# Altium schematic sheet 2211B_SysArrosage_auto.SchDoc: Systene d'arrosage auto
size 276 x 198 mm; Author: Garcia Luis; DrawnBy: Garcia Luis; Organization: ETML-ES; SheetNumber: 1; SheetTotal: 2
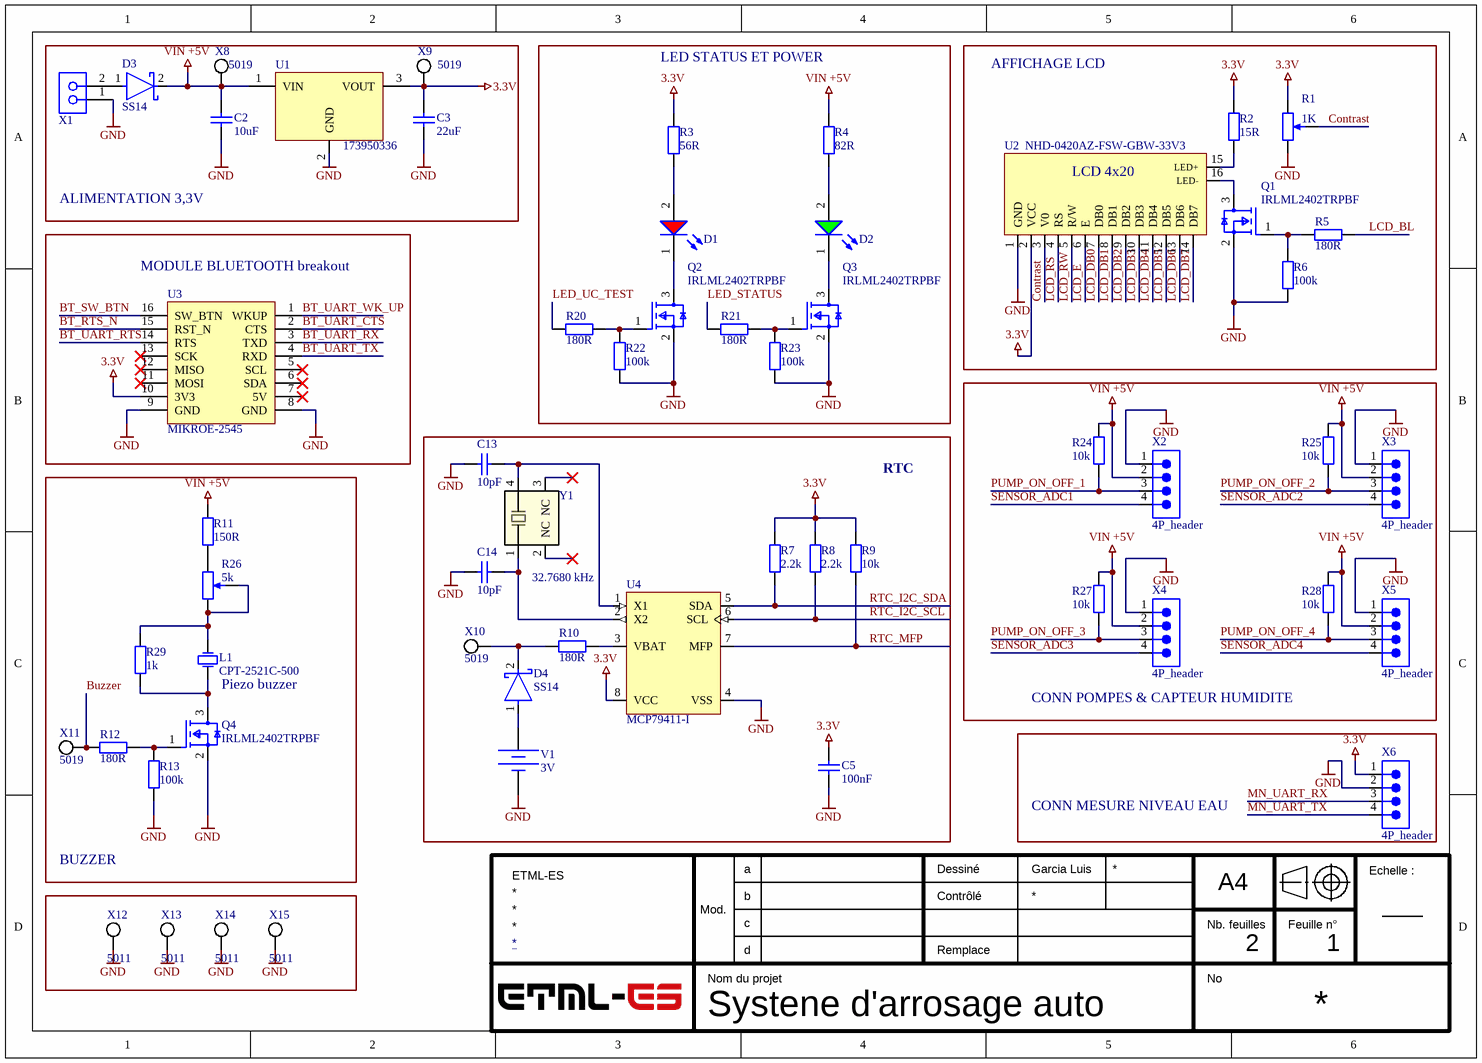
[diagram p0: 2211B_SysArrosage_auto.SchDoc]

## Parts
C2  10uF  [CAPC2013X145X48NL20T23]
C3  22uF  [CAPC2013X145X48NL20T23]
C5  100nF  [CAPC2013X145X48NL20T23]
C13  10pF  [CAPC2013X145X48NL20T23]
C14  10pF  [CAPC2013X145X48NL20T23]
D1  LED_Red_2A-1K  [LEDC2012X75N]  (value not drawn)
D2  LED_Green_2A-1K  [LEDC2012X75N]  (value not drawn)
D3  SS14  [FP-403AE-MFG]
D4  SS14  [FP-403AE-MFG]
L1  CPT-2521C-500  [61300211121]
Q1  IRLML2402TRPBF  [FP-Micro3-IPC_C]
Q2  IRLML2402TRPBF  [FP-Micro3-IPC_C]
Q3  IRLML2402TRPBF  [FP-Micro3-IPC_C]
Q4  IRLML2402TRPBF  [FP-Micro3-IPC_C]
R1  1K  [TRIM_3362P-1-1K]
R2  15R  [RESC2012X60N]
R3  56R  [RESC2012X60N]
R4  82R  [RESC2012X60N]
R5  180R  [RESC2012X60N]
R6  100k  [RESC2012X60N]
R7  2.2k  [RESC2012X60N]
R8  2.2k  [RESC2012X60N]
R9  10k  [RESC2012X60N]
R10  180R  [RESC2012X60N]
R11  150R  [RESC2012X60N]
R12  180R  [RESC2012X60N]
R13  100k  [RESC2012X60N]
R20  180R  [RESC2012X60N]
R21  180R  [RESC2012X60N]
R22  100k  [RESC2012X60N]
R23  100k  [RESC2012X60N]
R24  10k  [RESC2012X60N]
R25  10k  [RESC2012X60N]
R26  5k  [TRIM_3386P-1-502LF_5K]
R27  10k  [RESC2012X60N]
R28  10k  [RESC2012X60N]
R29  1k  [RESC2012X60N]
U1  173950336  [WPME-FDSM_SIP-3_L11.6W7.55H10.16]
U2  NHD-0420AZ-FSW-GBW-33V3  [NHD-0420AZ-FSW-GBW-33V3]
U3  MIKROE-2545  [RN4678 CLICK V3]
U4  MCP79411-I  [SOIC-SN8_M]
V1  DC Magnitude: 3V  [BAT_BU2032SM-HD-G]  (hidden comment: Pile 3V)
X1  Header 1x2  [691214110002]  (value not drawn)
X2  4P_header  [61300411121]
X3  4P_header  [61300411121]
X4  4P_header  [61300411121]
X5  4P_header  [61300411121]
X6  4P_header  [61300411121]
X8  5019  [KEYSTONE_5019]
X9  5019  [KEYSTONE_5019]
X10  5019  [KEYSTONE_5019]
X11  5019  [KEYSTONE_5019]
X12  5011  [Keystone_5011]
X13  5011  [Keystone_5011]
X14  5011  [Keystone_5011]
X15  5011  [Keystone_5011]
Y1  32.7680 kHz  [SOJ_MC-306_EPS-M]

## Blocks framed on the sheet
ALIMENTATION 3,3V: C2 C3 D3 U1 X1 X8 X9
LED STATUS ET POWER: D1 D2 Q2 Q3 R3 R4 R20-R23
AFFICHAGE LCD: Q1 R1 R2 R5 R6 U2
MODULE BLUETOOTH breakout: U3
RTC: C5 C13 C14 D4 R7-R10 U4 V1 X10 Y1
CONN POMPES & CAPTEUR HUMIDITE: R24 R25 R27 R28 X2-X5
CONN MESURE NIVEAU EAU: X6

## Nets
3.3V: C3.2 C5.2 R1.3(CW) R2.2 R3.2 R7.2 R8.2 R9.2 U1.3(VOUT) U2.2(VCC) U3.10(3V3) U4.8(VCC) X6.1 X9.1(TP)
GND: C2.1 C3.1 C5.1 C13.1 C14.1 Q1.2(S) Q2.2(S) Q3.2(S) Q4.2(S) R1.1(CCW) R6.1 R13.2 R22.1 R23.1 U1.2(GND) U2.1(GND) U3.8(GND) U3.9(GND) U4.4(VSS) V1.2 X1.1 X2.1 X3.1 X4.1 X5.1 X6.2 X12.1(TP) X13.1(TP) X14.1(TP) X15.1(TP)
VIN +5V: C2.2 D3.2(C) R4.2 R11.2 R24.2 R25.2 R27.2 R28.2 U1.1(VIN) X2.2 X3.2 X4.2 X5.2 X8.1(TP)
BT_RTS_N: U3.15(RST_N)
BT_SW_BTN: U3.16(SW_BTN)
BT_UART_CTS: U3.2(CTS)
BT_UART_RTS: U3.14(RTS)
BT_UART_RX: U3.3(TXD)
BT_UART_TX: U3.4(RXD)
BT_UART_WK_UP: U3.1(WKUP)
Buzzer: R12.2 X11.1(TP)
Contrast: R1.2(W) U2.3(V0)
LCD_BL: R5.1
LCD_DB0: U2.7(DB0)
LCD_DB1: U2.8(DB1)
LCD_DB2: U2.9(DB2)
LCD_DB3: U2.10(DB3)
LCD_DB4: U2.11(DB4)
LCD_DB5: U2.12(DB5)
LCD_DB6: U2.13(DB6)
LCD_DB7: U2.14(DB7)
LCD_E: U2.6(E)
LCD_RS: U2.4(RS)
LCD_RW: U2.5(R/W)
LED_STATUS: R21.2
LED_UC_TEST: R20.2
MN_UART_RX: X6.3
MN_UART_TX: X6.4
PUMP_ON_OFF_1: R24.1 X2.3
PUMP_ON_OFF_2: R25.1 X3.3
PUMP_ON_OFF_3: R27.1 X4.3
PUMP_ON_OFF_4: R28.1 X5.3
RTC_I2C_SCL: R8.1 U4.6(SCL)
RTC_I2C_SDA: R7.1 U4.5(SDA)
RTC_MFP: R9.1 U4.7(MFP)
SENSOR_ADC1: X2.4
SENSOR_ADC2: X3.4
SENSOR_ADC3: X4.4
SENSOR_ADC4: X5.4
NetC13_2: C13.2 U4.1(X1) Y1.4
NetC14_2: C14.2 U4.2(X2) Y1.1
NetD1_1: D1.1(K) Q2.3(D)
NetD1_2: D1.2(A) R3.1
NetD2_1: D2.1(K) Q3.3(D)
NetD2_2: D2.2(A) R4.1
NetD3_1: D3.1(A) X1.2
NetD4_1: D4.1(A) V1.1
NetD4_2: D4.2(C) R10.2 X10.1(TP)
NetL1_1: L1.1 Q4.3(D) R29.1
NetL1_2: L1.2 R26.1(CCW) R26.2(W) R29.2
NetQ1_1: Q1.1(G) R5.2 R6.2
NetQ1_3: Q1.3(D) U2.16(LED-)
NetQ2_1: Q2.1(G) R20.1 R22.2
NetQ3_1: Q3.1(G) R21.1 R23.2
NetQ4_1: Q4.1(G) R12.1 R13.1
NetR2_1: R2.1 U2.15(LED+)
NetR10_1: R10.1 U4.3(VBAT)
NetR11_1: R11.1 R26.3(CW)

Not connected (* = marked no-connect by the designer): U3 5(SCL)* 6(SDA)* 7(5V)* 11(MOSI)* 12(MISO)* 13(SCK)*; Y1 2(NC)* 3(NC)*

## Notes on the sheet
- (near L1) Piezo buzzer
- BUZZER
- a
- Dessiné
- A4
- Echelle :
- Mod.
- b
- c
- d
- Contrôlé
- Remplace
- Nb. feuilles
- Feuille n°
- Nom du projet
- No
- (in symbol NHD-0420AZ-FSW-GBW-33V3) LCD 4x20

## Library data of the parts
C2 C3 C5 C13 C14 = Capacitor_Non-Polarized
  C2: Capacité: 10uF
  C3: Capacité: 22uF
  C5: Capacité: 100nF
  C13 C14: Capacité: 10pF
D1 = LED_Red_2A-1K: LED Uni-Color Hyper Red 640nm 2-Pin Chip LED T/R; Manufacturer: Kingbright; Manufacturer Part Number: APT2012SECK/J3-PRV; Lens Color: Colorless; Forward Current: 20mA; Forward Voltage: 2.2V; Luminous Intensity: 350mcd; Viewing Angle: 120°; Lens Transparency: Clear; Dominant Wavelength: 625nm; Lens Style: Flat; Lens Size: 1.25mm; Supplier: Digikey; Supplier Part Number: 754-1791-1-ND; RoHS: Yes; Category: LEDs; Stock: 46358; Pricing: 1=0.6, 10=0.368, 100=0.2114, 1000=0.16544 (USD); Mounting Technology: Surface Mount; Case/Package: 0805; Case Code (Metric): 2012; Case Code (Imperial): 0805; Color: Red; Min Operating Temperature: -40°C; Max Operating Temperature: 85°C; Illumination Color: Red; Packaging: Tape and Reel; Package Quantity: 1; Test Current: 20mA; Series: HELI2; Length: 2mm; Width: 1.25mm; Height: 0.75mm; Lead Free: Lead Free; RoHS Compliant: Yes; ComponentLink1URL: https://datasheet.ciiva.com/24022/apt2012seck-j3-prv-262303-24022777.pdf?src-supplier=Mouser; ComponentLink1Description: https://datasheet.ciiva.com/24022/apt2012seck-j3-prv-262303-24022777.pdf?src-supplier=Mouser; ComponentLink2URL: https://datasheet.ciiva.com/29562/apt2012seck-j3-prv-29562108.pdf?src-supplier=Digikey; ComponentLink2Description: https://datasheet.ciiva.com/29562/apt2012seck-j3-prv-29562108.pdf?src-supplier=Digikey
D2 = LED_Green_2A-1K: LED Uni-Color Green 515nm 2-Pin SMD T/R; Manufacturer: Kingbright; Manufacturer Part Number: APHCM2012ZGCK-F01; Lens Color: Colorless; Lens Style: Flat; Lens Transparency: Clear; Luminous Intensity: 350mcd; Forward Voltage: 3.3V; Test Current: 20mA; Viewing Angle: 110°; Dominant Wavelength: 525nm; Lens Size: 1.2mm; Supplier: Digikey; Supplier Part Number: 754-2120-1-ND; RoHS: Yes; Category: LEDs; Stock: 17088; Pricing: 1=0.51, 10=0.311, 100=0.1789, 1000=0.13999 (USD); Mounting Technology: Surface Mount; Case/Package: 0805; Color: Green; Case Code (Imperial): 0805; Case Code (Metric): 2012; Packaging: Cut Tape; Series: -; Length: 2mm; Width: 1.25mm; Height: 0.5mm; RoHS Compliant: Yes; ComponentLink1URL: http://www.kingbrightusa.com/images/catalog/SPEC/APHCM2012ZGCK-F01.pdf?src-supplier=Digikey; ComponentLink1Description: http://www.kingbrightusa.com/images/catalog/SPEC/APHCM2012ZGCK-F01.pdf?src-supplier=Digikey
D3 D4 = CMP-2000-04943-2: DIODE SCHOTTKY 40V 1A SMA; Manufacturer: ON Semiconductor; Peak Reverse Current: 0.2mA; Max Junction Temp: +125°C; Standoff Height: 0.05mm; Max Surge Forward Current: 40A; Mouser Description: Schottky Diodes & Rectifiers SMA 40V 1.0A; RoHS: TRUE; Lead Free: Yes; Manufacturer Part Number: SS14; Device Class L3: Schottky Diodes; Category: Diode; Automotive: No; Digikey Description: DIODE SCHOTTKY 40V 1A SMA; ComponentLink2Description: Datasheet; Device Class L2: Diodes; Height: 2.5mm; Temperature Range High: +125°C; ComponentLink2URL: https://www.onsemi.com/pub/Collateral/SS19-D.PDF; Device Class L1: Discrete Semiconductors; Package: 403AE; Octopart: https://octopart.com/ss14-on+semiconductor-29205033; Max Repetitive Reverse Voltage: 40V; Temperature Range Low: -65°C; Forward Current: 1A; Temperature: -65°C to +125°C
L1 = Buzzer: AUDIO PIEZO TRANSDUCER 50V CHAS; Manufacturer: CUI Devices; Supplier: Digikey; Supplier Part Number: 102-3756-ND; Manufacturer Part Number: CPT-2521C-500; RoHS: No; Category: Buzzers; Stock: 2415; Pricing: 1=5.57, 10=4.594, 30=4.23467, 60=3.97467, 90=3.72456, 450=3.29809 (USD); ComponentLink1URL: https://www.cuidevices.com/product/resource/digikeypdf/cpt-2521c-500.pdf?src-supplier=Digikey; ComponentLink1Description: https://www.cuidevices.com/product/resource/digikeypdf/cpt-2521c-500.pdf?src-supplier=Digikey
Q1-Q4 = CMP-32901-000179-1: MOSFET N-CH 20V 1.2A SOT-23; Manufacturer: Infineon; Max Power Dissipation: 540mW; Gate to Source Voltage (Vgs): 12V; Drain to Source Resistance: 350mR; Rise Time: 9.5ns; Threshold Voltage: 700mV; Turn-On Delay Time: 2.5ns; Input Capacitance: 110pF; Element Configuration: Single; Power Dissipation: 540W; Turn-Off Delay Time: 9.7ns; Rds On Max: 250mR; REACH SVHC: No SVHC; Mount: Surface Mount; Packaging: Tape and Reel; Height: 0.04inch; Drain to Source Voltage (Vdss): 20V; Length: 0.119inch; Contact Plating: Tin; Continuous Drain Current (ID): 1.2A; Lead Free: Lead Free; Drain to Source Breakdown Voltage: 20V; Max Dual Supply Voltage: 20V; Number of Pins: 3; Halogen Free: Halogen Free; Max Operating Temperature: 150°C; Case/Package: SOT-23; Min Operating Temperature: -55°C; Width: 0.055inch; Manufacturer Part Number: IRLML2402TRPBF
R1 = RPot: In a Tube of 50, 1kO Through Hole Trimmer Potentiometer 0.5W Top Adjust Bourns 3362 Series; Manufacturer Part Number: 3362P-1-102LF; Manufacturer Series: 3362; Tolerance: 10%; Number of Turns: 1; Voltage Rating (AC): 300V; Power Rating: 500mW; Temperature Coefficient: 100ppm/°C; Resistance Law: Linear; Actuator Orientation: Vertical; Actuator Type: SCREW; Lead Diameter: 0.46mm; Resistance: 1kR; Published: 17-Dec-2003; DatasheetVersion: Oct-2003; PackageReference: POT4MM-2; Publisher: Altium Limited; PackageDescription: Square Trimming Potentiometer; ComponentLink1Description: Manufacturer Link; ComponentLink1URL: http://bourns.com/2/search.html; Supplier 1: Arrow Electronics; Manufacturer: Bourns; RoHS: Yes; Category: Variable Resistors and Potentiometers; Stock 1: 2500; Pricing 1: 250=0,5725, 500=0,5525, 1000=0,5024, 2500=0,4458, 10000=0,4425 (USD); Mount: Through Hole,PCB; Number of Pins: 3; Weight: 0.02oz; Terminal Finish: Tin; Color: 48Colour; Min Operating Temperature: -55°C; Max Operating Temperature: 125°C; Packaging: Rail/Tube; Resistor Type: Cermet; Termination: Pin; Series: Trimpot® 3362 - Sealed; Voltage Rating (DC): 300V; Voltage Rating: 300V; Taper: Linear; Max Power Dissipation: 500mW; Type: Potentiometer; Technology: CERMET; Resistance Tolerance: 10%; Package Quantity: 250; Length: 6.6mm; Width: 6.6mm; Height: 0.185inch; Depth: 6.99mm; Radiation Hardening: No; Reach SVHC Compliant: No; Military Standard: Not; Lead Free: Contains Lead; RoHS Compliant: Yes; ComponentLink2URL: https://datasheet.ciiva.com/11831/0900766b8069ccf8-11831281.pdf?src-supplier=Rs; ComponentLink2Description: https://datasheet.ciiva.com/11831/0900766b8069ccf8-11831281.pdf?src-supplier=Rs; ComponentLink3URL: https://datasheet.ciiva.com/19466/854663-19466804.pdf?src-supplier=Jameco; ComponentLink3Description: https://datasheet.ciiva.com/19466/854663-19466804.pdf?src-supplier=Jameco; ComponentLink4URL: https://datasheet.ciiva.com/29122/447329-da-01-en-trimmer-tht3362p-1-102lf-1k-0-5w-29122260.pdf?src-supplier=Conrad; ComponentLink4Description: https://datasheet.ciiva.com/29122/447329-da-01-en-trimmer-tht3362p-1-102lf-1k-0-5w-29122260.pdf?src-supplier=Conrad; ComponentLink5URL: https://datasheet.ciiva.com/14108/mk3362-dat-e-14108840.pdf?src-supplier=Distrelec; ComponentLink5Description: https://datasheet.ciiva.com/14108/mk3362-dat-e-14108840.pdf?src-supplier=Distrelec; ComponentLink6URL: https://datasheet.ciiva.com/3266/3362-3266298.pdf?src-supplier=Avnet; ComponentLink6Description: https://datasheet.ciiva.com/3266/3362-3266298.pdf?src-supplier=Avnet; ComponentLink7URL: https://datasheet.ciiva.com/2156/3362-2156394.pdf?src-supplier=Digikey; ComponentLink7Description: https://datasheet.ciiva.com/2156/3362-2156394.pdf?src-supplier=Digikey; ComponentLink8URL: https://datasheet.ciiva.com/30213/3362-30213113.pdf?src-supplier=Onlinecomponents.com; ComponentLink8Description: https://datasheet.ciiva.com/30213/3362-30213113.pdf?src-supplier=Onlinecomponents.com; ComponentLink9URL: https://datasheet.ciiva.com/16715/70153603-16715030.pdf?src-supplier=Allied+Electronics; ComponentLink9Description: https://datasheet.ciiva.com/16715/70153603-16715030.pdf?src-supplier=Allied+Electronics; Supplier Part Number 1: 3362P-1-102LF
R2 R3 R5-R13 R20-R25 R27-R29 = R-SMD: SMD Chip Resistor, 10 kOhm, ± 1%, 125 mW, 0805 [2012 Metric], Thick Film, General Purpose; Manufacturer: Yageo; Manufacturer Part Number: RC0805FR-0710KL; Temperature Coefficient: 100ppm/°C; Power Rating: 125mW; Voltage Rating: 150V; Supplier: Rs; Supplier Part Number: 6185163; RoHS: Yes; Category: Chip SMD Resistors; Stock: 360000; Pricing: 1=24.917 (CHF); Case/Package: 0805; Case Code (Imperial): 0805; Case Code (Metric): 2012; Min Operating Temperature: -55°C; Max Operating Temperature: 155°C; Packaging: Tape and Reel; Tolerance: 1%; Resistor Type: Thick Film; Package Quantity: 1; Termination: SMD/SMT; Number of Terminations: 2; Max Power Dissipation: 125mW; Features: Moisture Resistant; Series: RC; Construction: Rectangular; Resistance Tolerance: 1%; Technology: THICK FILM; Voltage Rating (AC): 150V; Length: 0.079inch; Width: 0.049inch; Height: 0.024inch; Depth: 1.25mm; Lead Free: Lead Free; Reach SVHC Compliant: Unknown; Military Standard: Not; RoHS Compliant: Yes; ComponentLink1URL: https://datasheet.ciiva.com/11808/0900766b8106beab-11808151.pdf?src-supplier=Rs; ComponentLink1Description: https://datasheet.ciiva.com/11808/0900766b8106beab-11808151.pdf?src-supplier=Rs; ComponentLink2URL: https://datasheet.ciiva.com/46447/444164-46447563.pdf?src-supplier=Element14; ComponentLink2Description: https://datasheet.ciiva.com/46447/444164-46447563.pdf?src-supplier=Element14; ComponentLink3URL: https://datasheet.ciiva.com/2456/pyu-r-int-thick-7-2456973.pdf?src-supplier=Digikey; ComponentLink3Description: https://datasheet.ciiva.com/2456/pyu-r-int-thick-7-2456973.pdf?src-supplier=Digikey; ComponentLink4URL: https://datasheet.ciiva.com/2456/pyu-r-int-thick-7-2456974.pdf?src-supplier=Digikey; ComponentLink4Description: https://datasheet.ciiva.com/2456/pyu-r-int-thick-7-2456974.pdf?src-supplier=Digikey; ComponentLink5URL: https://datasheet.ciiva.com/2456/pyu-r-int-thick-7-2456972.pdf?src-supplier=Digikey; ComponentLink5Description: https://datasheet.ciiva.com/2456/pyu-r-int-thick-7-2456972.pdf?src-supplier=Digikey; ComponentLink6URL: https://datasheet.ciiva.com/12669/rc0805-12669688.pdf?src-supplier=Mouser; ComponentLink6Description: https://datasheet.ciiva.com/12669/rc0805-12669688.pdf?src-supplier=Mouser
  R2: Value: 15R
  R3: Value: 56R
  R5 R10 R12 R20 R21: Value: 180R
  R6 R13 R22 R23: Value: 100k
  R7 R8: Value: 2.2k
  R9 R24 R25 R27 R28: Value: 10k
  R11: Value: 150R
  R29: Value: 1k
R4 = R-SMD: SMD Chip Resistor, 10 kOhm, ± 1%, 125 mW, 0805 [2012 Metric], Thick Film, General Purpose; Manufacturer: Yageo; Manufacturer Part Number: RC0805FR-0710KL; Value: 86R; Temperature Coefficient: 100ppm/°C; Power Rating: 125mW; Voltage Rating: 150V; Supplier: Rs; Supplier Part Number: 6185163; RoHS: Yes; Category: Chip SMD Resistors; Stock: 360000; Pricing: 1=24.917 (CHF); Case/Package: 0805; Case Code (Imperial): 0805; Case Code (Metric): 2012; Min Operating Temperature: -55°C; Max Operating Temperature: 155°C; Packaging: Tape and Reel; Tolerance: 1%; Resistor Type: Thick Film; Package Quantity: 1; Termination: SMD/SMT; Number of Terminations: 2; Max Power Dissipation: 125mW; Features: Moisture Resistant; Series: RC; Construction: Rectangular; Resistance Tolerance: 1%; Technology: THICK FILM; Voltage Rating (AC): 150V; Length: 0.079inch; Width: 0.049inch; Height: 0.024inch; Depth: 1.25mm; Lead Free: Lead Free; Reach SVHC Compliant: Unknown; Military Standard: Not; RoHS Compliant: Yes; ComponentLink1URL: https://datasheet.ciiva.com/11808/0900766b8106beab-11808151.pdf?src-supplier=Rs; ComponentLink1Description: https://datasheet.ciiva.com/11808/0900766b8106beab-11808151.pdf?src-supplier=Rs; ComponentLink2URL: https://datasheet.ciiva.com/46447/444164-46447563.pdf?src-supplier=Element14; ComponentLink2Description: https://datasheet.ciiva.com/46447/444164-46447563.pdf?src-supplier=Element14; ComponentLink3URL: https://datasheet.ciiva.com/2456/pyu-r-int-thick-7-2456973.pdf?src-supplier=Digikey; ComponentLink3Description: https://datasheet.ciiva.com/2456/pyu-r-int-thick-7-2456973.pdf?src-supplier=Digikey; ComponentLink4URL: https://datasheet.ciiva.com/2456/pyu-r-int-thick-7-2456974.pdf?src-supplier=Digikey; ComponentLink4Description: https://datasheet.ciiva.com/2456/pyu-r-int-thick-7-2456974.pdf?src-supplier=Digikey; ComponentLink5URL: https://datasheet.ciiva.com/2456/pyu-r-int-thick-7-2456972.pdf?src-supplier=Digikey; ComponentLink5Description: https://datasheet.ciiva.com/2456/pyu-r-int-thick-7-2456972.pdf?src-supplier=Digikey; ComponentLink6URL: https://datasheet.ciiva.com/12669/rc0805-12669688.pdf?src-supplier=Mouser; ComponentLink6Description: https://datasheet.ciiva.com/12669/rc0805-12669688.pdf?src-supplier=Mouser
R26 = Rpot_5K: Cermet Not Linear VERTICAL Trimmer Potentiometer 卤10% 280deg 500mW 85C; Manufacturer: Bourns; Manufacturer Part Number: 3386P-1-502LF; Voltage Rating (AC): 300V; Supplier: Rs; Supplier Part Number: 5222772P; RoHS: Yes; Category: Variable Resistors and Potentiometers; Stock: 436; Pricing: 10=1.166, 100=1.029, 500=0.871, 1000=0.798 (CHF); ComponentLink1URL: https://datasheet.ciiva.com/11831/0900766b8069ccf9-11831043.pdf?src-supplier=Rs; ComponentLink1Description: https://datasheet.ciiva.com/11831/0900766b8069ccf9-11831043.pdf?src-supplier=Rs; ComponentLink2URL: https://datasheet.ciiva.com/27051/1158379-27051564.pdf?src-supplier=Jameco; ComponentLink2Description: https://datasheet.ciiva.com/27051/1158379-27051564.pdf?src-supplier=Jameco; ComponentLink3URL: https://datasheet.ciiva.com/29122/447392-da-01-en-trimmer-tht3386p-1-502lf-5k-0-5w-29122217.pdf?src-supplier=Conrad; ComponentLink3Description: https://datasheet.ciiva.com/29122/447392-da-01-en-trimmer-tht3386p-1-502lf-5k-0-5w-29122217.pdf?src-supplier=Conrad; ComponentLink4URL: https://datasheet.ciiva.com/2156/3386-2156421.pdf?src-supplier=Digikey; ComponentLink4Description: https://datasheet.ciiva.com/2156/3386-2156421.pdf?src-supplier=Digikey; ComponentLink5URL: https://datasheet.ciiva.com/5005/3386-21463-5005193.pdf?src-supplier=Mouser; ComponentLink5Description: https://datasheet.ciiva.com/5005/3386-21463-5005193.pdf?src-supplier=Mouser; ComponentLink6URL: https://datasheet.ciiva.com/14108/sa3386-dat-e-14108981.pdf?src-supplier=Distrelec; ComponentLink6Description: https://datasheet.ciiva.com/14108/sa3386-dat-e-14108981.pdf?src-supplier=Distrelec; ComponentLink7URL: https://datasheet.ciiva.com/16714/70153604-16714749.pdf?src-supplier=Allied+Electronics; ComponentLink7Description: https://datasheet.ciiva.com/16714/70153604-16714749.pdf?src-supplier=Allied+Electronics; ComponentLink8URL: https://datasheet.ciiva.com/7953/1815119-7953130.pdf?src-supplier=Element14; ComponentLink8Description: https://datasheet.ciiva.com/7953/1815119-7953130.pdf?src-supplier=Element14
U1 = CMP-03913-104891430-1: 173950336 WPME-FDSM Fixed Step Down Regulator Module; Output Current: 500mA; Max Switching Frequency: 520kHz; Min Input Voltage: 4.75V; Max Input Voltage: 36V; Max Output Voltage: 3.3V; Min Operating Temperature: -40°C; Height: 10.16mm; Ambient Temperature Range Low: -40°C; NexarPartId: 104891430; Max Operating Temperature: 125°C; Length: 11.6mm; Width: 7.55mm; Ambient Temperature Range High: 85°C; RoHS: Compliant
U2 = NHD-0420AZ-FSW-GBW-33V3: Character Display STN Transflective 20Char x 4Line 16-Pin; Manufacturer: Newhaven Display; Supplier: Digikey; Supplier Part Number: NHD-0420AZ-FSW-GBW-33V3-ND; Manufacturer Part Number: NHD-0420AZ-FSW-GBW-33V3; RoHS: Yes; Stock: 4272; Pricing: 1=22, 5=20.68, 10=19.36, 50=18.26, 100=17.3801, 250=16.50004, 500=15.84006 (USD); ComponentLink1URL: https://datasheet.ciiva.com/2102/nhd-0420az-fsw-gbw-33v3-2102502.pdf?src-supplier=Digikey; ComponentLink1Description: https://datasheet.ciiva.com/2102/nhd-0420az-fsw-gbw-33v3-2102502.pdf?src-supplier=Digikey; ComponentLink2URL: https://datasheet.ciiva.com/30249/6nhd-0420az-fsw-gbw-33v3-30249785.pdf?src-supplier=Onlinecomponents.com; ComponentLink2Description: https://datasheet.ciiva.com/30249/6nhd-0420az-fsw-gbw-33v3-30249785.pdf?src-supplier=Onlinecomponents.com; ComponentLink3URL: https://datasheet.ciiva.com/24396/6nhd-0420az-fsw-gbw-33v3-24396711.pdf?src-supplier=Onlinecomponents.com; ComponentLink3Description: https://datasheet.ciiva.com/24396/6nhd-0420az-fsw-gbw-33v3-24396711.pdf?src-supplier=Onlinecomponents.com; ComponentLink4URL: https://datasheet.ciiva.com/49271/70518142-49271835.pdf?src-supplier=Allied+Electronics; ComponentLink4Description: https://datasheet.ciiva.com/49271/70518142-49271835.pdf?src-supplier=Allied+Electronics
U3 = RN4678_CLICK_SOCKET: RN4678 Click Bluetooth Communications Module; Manufacturer: mikroElektronika; Parameter 1: *; Supplier: Rs; Supplier Part Number: 1683004; Manufacturer Part Number: MIKROE-2545; RoHS: No; Category: RF Semiconductors and Devices; Stock: 16; Pricing: 1=37.013, 2=35.532, 5=33.947, 10=33.065, 25=32.256 (CHF); ComponentLink1URL: https://download.mikroe.com/documents/datasheets/bluetooth-4.2-dual-mode-module-datasheet.pdf?src-supplier=Digikey; ComponentLink1Description: https://download.mikroe.com/documents/datasheets/bluetooth-4.2-dual-mode-module-datasheet.pdf?src-supplier=Digikey
U4 = RTC: Real Time Clock Serial 64byte Clock/Calendar/Alarm/Battery Backup Automotive 8-Pin SOIC N Tube; Manufacturer: Microchip; Manufacturer Part Number: MCP79411-I/SN; Supplier: Rs; Supplier Part Number: 7985267P; RoHS: Yes; Category: Real Time Clocks; Stock: 2150; Pricing: 30=1.264, 100=1.203 (CHF); ComponentLink1URL: https://datasheet.ciiva.com/8145/22266b-8145061.pdf?src-supplier=Avnet; ComponentLink1Description: https://datasheet.ciiva.com/8145/22266b-8145061.pdf?src-supplier=Avnet; ComponentLink2URL: https://datasheet.ciiva.com/6667/22266d-6667782.pdf?src-supplier=Digikey; ComponentLink2Description: https://datasheet.ciiva.com/6667/22266d-6667782.pdf?src-supplier=Digikey
V1 = Battery: SimulationGenericComponent: True
X1 = Header 1x2: Conn Terminal Block 2 POS 3.5mm Solder ST Thru-Hole 10A Box; Manufacturer: Wurth Electronics; Plating: Brass,Steel; Number of Levels: 1; Number of Positions Per Level: 2; Voltage: 300V; Wire Gauge (Max): 24AWG; Wire Gauge (Min): 16AWG; Stripping Length: -6mm; Supplier: Rs; Supplier Part Number: 8267295; Manufacturer Part Number: 691214110002; RoHS: Yes; Category: Terminal Blocks; Stock: 313; Pricing: 1=0.924, 10=0.819, 50=0.756, 500=0.672, 1000=0.619 (CHF); Mounting Technology: Through Hole; Color: Blue,Green; Contact Plating: Brass,Tin; Housing Material: PA66; Contact Material: Brass; Min Operating Temperature: -40°C; Max Operating Temperature: 105°C; Current: 10A; Termination: Screw; Series: WR-TBL Series 2141; Voltage Rating: 300V; Current Rating: 10A; Number of Contacts: 2; Number of Rows: 1NUMBER; Length: 7.4mm; Width: 7.9mm; Height: 12.2mm; Wire/Cable Gauge: 24AWG; Pitch: 3.5mm; RoHS Compliant: Yes; Reach SVHC Compliant: Unknown; ComponentLink1URL: https://datasheet.ciiva.com/824/6912141100xx-824001.pdf?src-supplier=Digikey; ComponentLink1Description: https://datasheet.ciiva.com/824/6912141100xx-824001.pdf?src-supplier=Digikey; ComponentLink2URL: https://datasheet.ciiva.com/48693/001088618-da-01-en-wr-tbl-terminal-block2141-691214110002-48693195.pdf?src-supplier=Conrad; ComponentLink2Description: https://datasheet.ciiva.com/48693/001088618-da-01-en-wr-tbl-terminal-block2141-691214110002-48693195.pdf?src-supplier=Conrad
X2-X6 = 4P_header: THT Vertical Pin Header WR-PHD, Pitch 2.54 mm, Single Row, 4 pins; Manufacturer: Wurth Electronics; Current Rating: 3A; Operating Supply Voltage: 250V; Number of Positions: 4; Gender: Male; Contact Resistance: 20mR; Pitch: 0.1inch; Supplier: Rs; Supplier Part Number: 8281594P; Manufacturer Part Number: 61300411121; RoHS: Yes; Category: Headers and Wire Housings; Stock: 2885; Pricing: 250=0.08, 500=0.078, 2500=0.076, 5000=0.074 (CHF); Mounting Technology: Through Hole; Contact Plating: Gold; Contact Material: Copper; Color: Black; Min Operating Temperature: -40°C; Max Operating Temperature: 105°C; Number of Rows: 1; Packaging: Bulk; Termination: Solder; Series: WR-PHD; Orientation: 5495OrientationType; Voltage Rating: 250V; Number of Contacts: 4; Contact Type: Male Pin; Height: 8.89mm; Contact Mating Length: 0.236inch; Lead Free: Lead Free; RoHS Compliant: Yes; Reach SVHC Compliant: Unknown; ComponentLink1URL: http://www.farnell.com/cad/1737268.pdf?src-supplier=Element14; ComponentLink1Description: http://www.farnell.com/cad/1737268.pdf?src-supplier=Element14; ComponentLink2URL: https://datasheet.octopart.com/61300411121-W%C3%BCrth-Elektronik-datasheet-21154836.pdf?src-supplier=Element14; ComponentLink2Description: https://datasheet.octopart.com/61300411121-W%C3%BCrth-Elektronik-datasheet-21154836.pdf?src-supplier=Element14; ComponentLink3URL: https://katalog.we-online.de/em/datasheet/6130xx11121.pdf?src-supplier=Digikey; ComponentLink3Description: https://katalog.we-online.de/em/datasheet/6130xx11121.pdf?src-supplier=Digikey
X8-X11 = TEST_POINT_SMD: Test Point, Mini, SMT, Phos Bronze/Silver, 1000pc Tape & Reel | Keystone Electronics 5019; IsStocked: True; PN: PN-926990; Value: 5011; Plating: Silver; Body Material: Bronze; Supplier 1: ETML; Manufacturer: Keystone; Manufacturer Number: 5011; Supplier Part Number 1: MAG.428.014; Category: Connectors; SubCategory: Testpoints; Supplier Price 1: 0.2439; Manufacturer: Keystone Electronics; Manufacturer Part Number: 5011; Component Type: Connectors; Supplier: Farnell; Supplier Part Number: 2529475; RoHS: Yes; Stock: 8402; Pricing: 1=0.331, 10=0.302, 25=0.274, 50=0.251, 100=0.227, 250=0.204 (CHF); Mounting Technology: Surface Mount,PCB; Pins: 1; Contact Plating: Silver; Material: Bronze; Contact Material: Bronze; Packaging: Tape and Reel; Package Quantity: 1; Termination: SMD/SMT; Series: 5019; Height: 0.09inch; Reach SVHC Compliant: No; Lead Free: Lead Free; RoHS Compliant: Yes; ComponentLink1URL: https://datasheet.ciiva.com/16318/m60-2p61-16318395.pdf?src-supplier=Future+Electronics; ComponentLink1Description: https://datasheet.ciiva.com/16318/m60-2p61-16318395.pdf?src-supplier=Future+Electronics; ComponentLink2URL: https://datasheet.ciiva.com/14848/m60-2p61-14848438.pdf?src-supplier=Digikey; ComponentLink2Description: https://datasheet.ciiva.com/14848/m60-2p61-14848438.pdf?src-supplier=Digikey; ComponentLink3URL: https://datasheet.ciiva.com/14848/m60-2p61-14848439.pdf?src-supplier=Digikey; ComponentLink3Description: https://datasheet.ciiva.com/14848/m60-2p61-14848439.pdf?src-supplier=Digikey; ComponentLink4URL: https://datasheet.ciiva.com/14848/m60-2p61-14848437.pdf?src-supplier=Digikey; ComponentLink4Description: https://datasheet.ciiva.com/14848/m60-2p61-14848437.pdf?src-supplier=Digikey; ComponentLink5URL: https://datasheet.ciiva.com/16885/70182998-16885945.pdf?src-supplier=Allied+Electronics; ComponentLink5Description: https://datasheet.ciiva.com/16885/70182998-16885945.pdf?src-supplier=Allied+Electronics
X12-X15 = TEST_POINT_THT: TEST POINT, PCB, THROUGH HOLE; Product R; Range: -; Connector Colour: Black; Mounting: Through Hole; Manufacturer: Keystone; Manufacturer: Keystone Electronics; IsStocked: True; PN: PN-926990; Supplier 1: ETML; Value: 5011; Manufacturer Number: 5011; Supplier Part Number 1: MAG.428.014; Category: Connectors; SubCategory: Testpoints; Supplier Price 1: 0.2439; Manufacturer Part Number: 5011; Component Type: Connectors; Supplier: Rs; Supplier Part Number: 2042652; RoHS: Yes; Stock: 1300; Pricing: 100=0.37, 500=0.359, 1000=0.35, 4000=0.34 (CHF); ComponentLink1URL: https://datasheet.ciiva.com/11744/0900766b8009b7c7-11744935.pdf?src-supplier=Rs; ComponentLink1Description: https://datasheet.ciiva.com/11744/0900766b8009b7c7-11744935.pdf?src-supplier=Rs; ComponentLink2URL: https://datasheet.ciiva.com/1454/1718230-1454834.pdf?src-supplier=Element14; ComponentLink2Description: https://datasheet.ciiva.com/1454/1718230-1454834.pdf?src-supplier=Element14; ComponentLink3URL: https://datasheet.ciiva.com/46412/1703983-46412138.pdf?src-supplier=Element14; ComponentLink3Description: https://datasheet.ciiva.com/46412/1703983-46412138.pdf?src-supplier=Element14; ComponentLink4URL: https://datasheet.ciiva.com/16351/m60-2p60-16351093.pdf?src-supplier=Future+Electronics; ComponentLink4Description: https://datasheet.ciiva.com/16351/m60-2p60-16351093.pdf?src-supplier=Future+Electronics; ComponentLink5URL: https://datasheet.ciiva.com/2917/5011-2917635.pdf?src-supplier=Digikey; ComponentLink5Description: https://datasheet.ciiva.com/2917/5011-2917635.pdf?src-supplier=Digikey
Y1 = MC-306 32.7680K-A3: ROHS: CRYSTAL 32.7680KHZ 12.5PF SMD; Mfr_Name: Epson; Copyright: Copyright (C) 2024 Ultra Librarian. All rights reserved.; Manufacturer_Part_Number: MC-306 32.7680K-A3: ROHS; RefDes: RefDes; Type: DEV; Supplier: Digikey; Supplier Part Number: SER4306CT-ND; Manufacturer: Epson; Manufacturer Part Number: MC-30632.7680K-A3:ROHS; RoHS: Yes; Category: Crystals; Stock: 10888; Pricing: 1=2.61, 10=2.545, 50=2.424, 100=2.121 (USD); ComponentLink1URL: https://datasheet.ciiva.com/26941/getdatasheetpartid-777847-26941728.pdf?src-supplier=Verical; ComponentLink1Description: https://datasheet.ciiva.com/26941/getdatasheetpartid-777847-26941728.pdf?src-supplier=Verical